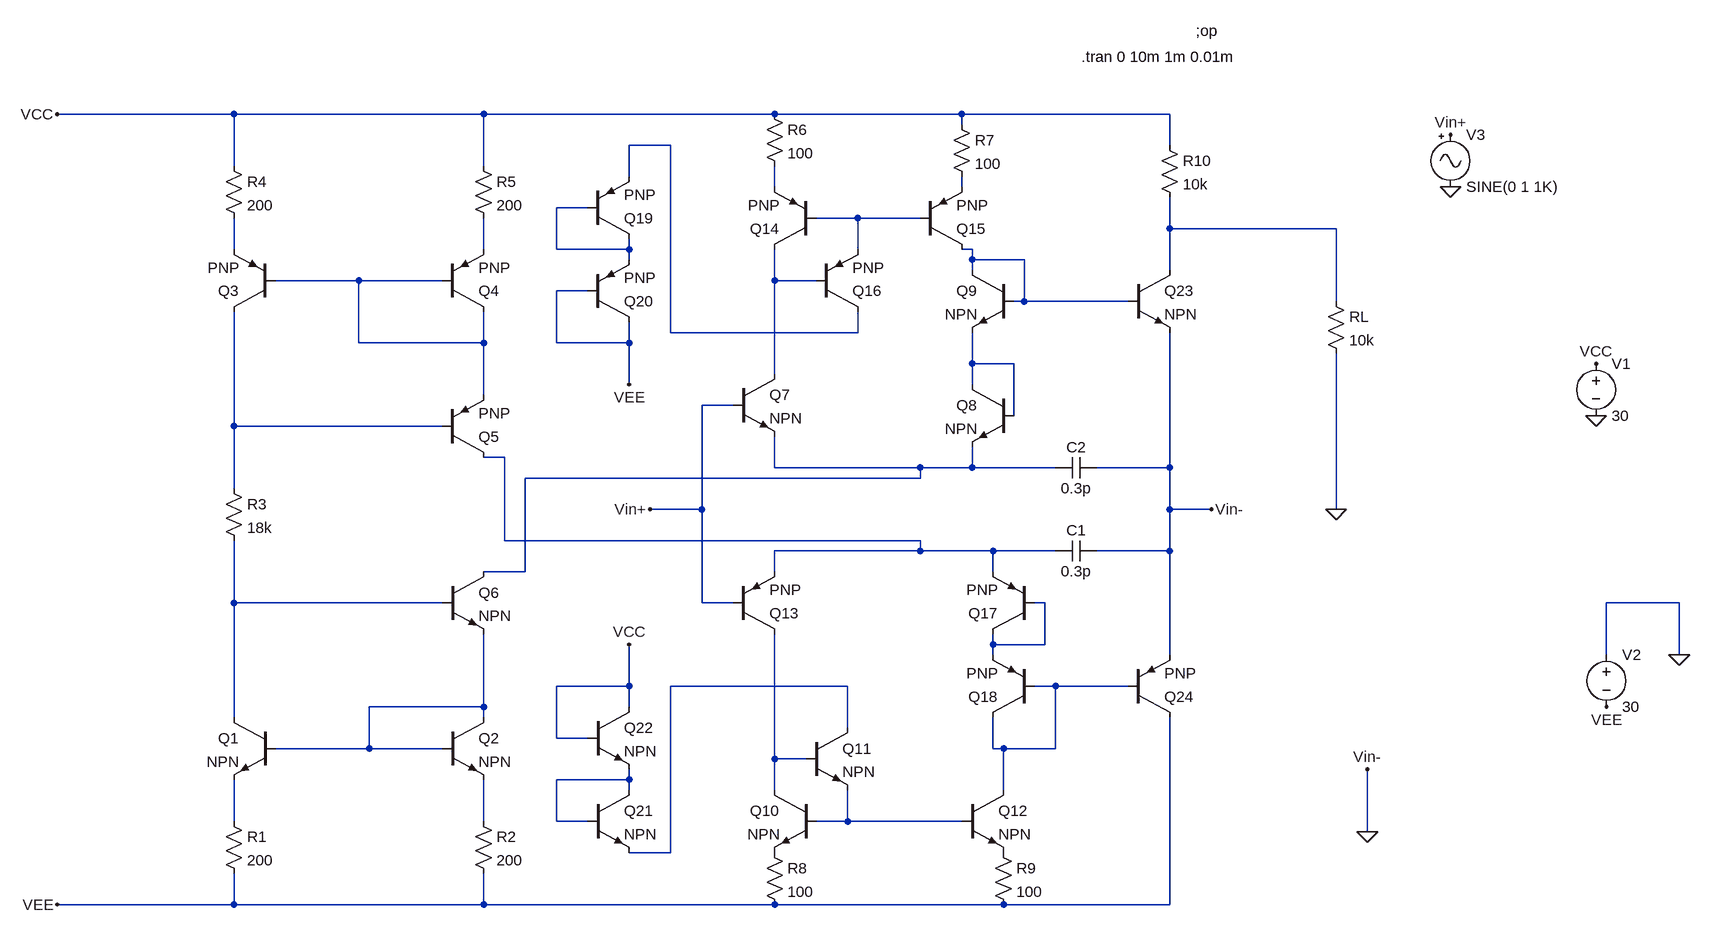
[diagram p0: schematic Draft1.asc]
Draft1.asc, the LTspice schematic file:
Version 4
SHEET 1 1828 1100
WIRE -416 -176 -688 -176
WIRE -32 -176 -416 -176
WIRE 416 -176 -32 -176
WIRE 704 -176 416 -176
WIRE 1024 -176 704 -176
WIRE 704 -160 704 -176
WIRE 256 -128 192 -128
WIRE 1024 -128 1024 -176
WIRE -416 -96 -416 -176
WIRE -32 -96 -32 -176
WIRE 192 -80 192 -128
WIRE 416 -64 416 -96
WIRE 704 -64 704 -80
WIRE 128 -32 80 -32
WIRE 544 -16 480 -16
WIRE 640 -16 544 -16
WIRE 1024 0 1024 -48
WIRE 1280 0 1024 0
WIRE -416 32 -416 -16
WIRE -32 32 -32 -16
WIRE 80 32 80 -32
WIRE 192 32 192 16
WIRE 192 32 80 32
WIRE 544 32 544 -16
WIRE 720 32 704 32
WIRE 192 48 192 32
WIRE 720 48 720 32
WIRE 800 48 720 48
WIRE 720 64 720 48
WIRE 1024 64 1024 0
WIRE -224 80 -352 80
WIRE -96 80 -224 80
WIRE 416 80 416 32
WIRE 480 80 416 80
WIRE 128 96 80 96
WIRE 800 112 800 48
WIRE 800 112 784 112
WIRE 960 112 800 112
WIRE 1280 112 1280 0
WIRE 256 160 256 -128
WIRE 544 160 544 128
WIRE 544 160 256 160
WIRE -224 176 -224 80
WIRE -32 176 -32 128
WIRE -32 176 -224 176
WIRE 80 176 80 96
WIRE 192 176 192 144
WIRE 192 176 80 176
WIRE 720 208 720 160
WIRE 784 208 720 208
WIRE 416 224 416 80
WIRE 192 240 192 176
WIRE 720 240 720 208
WIRE -32 256 -32 176
WIRE 352 272 304 272
WIRE 784 288 784 208
WIRE -416 304 -416 128
WIRE -96 304 -416 304
WIRE 0 352 -32 352
WIRE 416 368 416 320
WIRE 640 368 416 368
WIRE 720 368 720 336
WIRE 720 368 640 368
WIRE 848 368 720 368
WIRE 1024 368 1024 160
WIRE 1024 368 912 368
WIRE 640 384 640 368
WIRE 640 384 32 384
WIRE -416 400 -416 304
WIRE 304 432 304 272
WIRE 304 432 224 432
WIRE 1024 432 1024 368
WIRE 1088 432 1024 432
WIRE 1280 432 1280 192
WIRE 0 480 0 352
WIRE 640 480 0 480
WIRE 640 496 640 480
WIRE 640 496 416 496
WIRE 752 496 640 496
WIRE 848 496 752 496
WIRE 1024 496 1024 432
WIRE 1024 496 912 496
WIRE 32 528 32 384
WIRE 32 528 -32 528
WIRE 416 528 416 496
WIRE 752 528 752 496
WIRE -416 576 -416 480
WIRE -96 576 -416 576
WIRE 304 576 304 432
WIRE 352 576 304 576
WIRE 832 576 816 576
WIRE 1808 576 1696 576
WIRE 752 640 752 624
WIRE 832 640 832 576
WIRE 832 640 752 640
WIRE 752 656 752 640
WIRE 1024 656 1024 496
WIRE 1696 656 1696 576
WIRE 1808 656 1808 576
WIRE 192 704 192 640
WIRE 192 704 80 704
WIRE 528 704 256 704
WIRE 848 704 816 704
WIRE 960 704 848 704
WIRE -32 736 -32 624
WIRE -32 736 -208 736
WIRE 192 736 192 704
WIRE -416 752 -416 576
WIRE -32 752 -32 736
WIRE 528 768 528 704
WIRE 80 784 80 704
WIRE 128 784 80 784
WIRE -208 800 -208 736
WIRE -208 800 -352 800
WIRE -96 800 -208 800
WIRE 752 800 752 752
WIRE 768 800 752 800
WIRE 848 800 848 704
WIRE 848 800 768 800
WIRE 416 816 416 624
WIRE 464 816 416 816
WIRE 192 848 192 832
WIRE 192 848 80 848
WIRE 192 864 192 848
WIRE 416 864 416 816
WIRE 768 864 768 800
WIRE -416 912 -416 848
WIRE -32 912 -32 848
WIRE 80 912 80 848
WIRE 128 912 80 912
WIRE 528 912 528 864
WIRE 528 912 480 912
WIRE 704 912 528 912
WIRE 1328 928 1328 832
WIRE 256 960 256 704
WIRE 256 960 192 960
WIRE -416 1040 -416 992
WIRE -416 1040 -688 1040
WIRE -32 1040 -32 992
WIRE -32 1040 -416 1040
WIRE 416 1040 -32 1040
WIRE 768 1040 416 1040
WIRE 1024 1040 1024 752
WIRE 1024 1040 768 1040
FLAG -688 1040 VEE
FLAG -688 -176 VCC
FLAG 224 432 Vin+
FLAG 192 240 VEE
FLAG 192 640 VCC
FLAG 1088 432 Vin-
FLAG 1328 928 0
FLAG 1328 832 Vin-
FLAG 1680 208 VCC
FLAG 1680 288 0
FLAG 1808 656 0
FLAG 1696 736 VEE
FLAG 1456 -64 0
FLAG 1456 -144 Vin+
FLAG 1280 432 0
DATAFLAG 896 112 ""
DATAFLAG 1040 432 ""
DATAFLAG 288 432 ""
DATAFLAG 1280 224 ""
DATAFLAG 1024 368 ""
DATAFLAG 1024 368 ""
DATAFLAG 1024 368 ""
SYMBOL npn -352 752 M0
SYMATTR InstName Q1
SYMBOL npn -96 752 R0
SYMATTR InstName Q2
SYMBOL res -432 896 R0
SYMATTR InstName R1
SYMATTR Value 200
SYMBOL res -48 896 R0
SYMATTR InstName R2
SYMATTR Value 200
SYMBOL res -432 384 R0
SYMATTR InstName R3
SYMATTR Value 18k
SYMBOL res -432 -112 R0
SYMATTR InstName R4
SYMATTR Value 200
SYMBOL res -48 -112 R0
SYMATTR InstName R5
SYMATTR Value 200
SYMBOL pnp -352 128 R180
SYMATTR InstName Q3
SYMBOL pnp -96 128 M180
SYMATTR InstName Q4
SYMBOL pnp -96 352 M180
SYMATTR InstName Q5
SYMBOL npn -96 528 R0
SYMATTR InstName Q6
SYMBOL npn 352 224 R0
SYMATTR InstName Q7
SYMBOL npn 784 240 M0
SYMATTR InstName Q8
SYMBOL npn 784 64 M0
SYMATTR InstName Q9
SYMBOL npn 480 864 M0
SYMATTR InstName Q10
SYMBOL npn 464 768 R0
SYMATTR InstName Q11
SYMBOL npn 704 864 R0
SYMATTR InstName Q12
SYMBOL pnp 480 32 R180
SYMATTR InstName Q14
SYMBOL pnp 640 32 M180
SYMATTR InstName Q15
SYMBOL pnp 480 128 M180
SYMATTR InstName Q16
SYMBOL pnp 352 624 M180
SYMATTR InstName Q13
SYMBOL pnp 816 624 R180
SYMATTR InstName Q17
SYMBOL pnp 816 752 R180
SYMATTR InstName Q18
SYMBOL res 400 -192 R0
SYMATTR InstName R6
SYMATTR Value 100
SYMBOL res 688 -176 R0
SYMATTR InstName R7
SYMATTR Value 100
SYMBOL res 400 944 R0
SYMATTR InstName R8
SYMATTR Value 100
SYMBOL res 752 944 R0
SYMATTR InstName R9
SYMATTR Value 100
SYMBOL pnp 128 16 M180
SYMATTR InstName Q19
SYMBOL pnp 128 144 M180
SYMATTR InstName Q20
SYMBOL npn 128 864 R0
SYMATTR InstName Q21
SYMBOL npn 128 736 R0
SYMATTR InstName Q22
SYMBOL cap 912 480 R90
WINDOW 0 0 32 VBottom 2
WINDOW 3 32 32 VTop 2
SYMATTR InstName C1
SYMATTR Value 0.3p
SYMBOL cap 912 352 R90
WINDOW 0 0 32 VBottom 2
WINDOW 3 32 32 VTop 2
SYMATTR InstName C2
SYMATTR Value 0.3p
SYMBOL npn 960 64 R0
SYMATTR InstName Q23
SYMBOL pnp 960 752 M180
SYMATTR InstName Q24
SYMBOL voltage 1680 192 R0
WINDOW 123 0 0 Left 2
WINDOW 39 0 0 Left 2
SYMATTR InstName V1
SYMATTR Value 30
SYMBOL voltage 1696 640 R0
SYMATTR InstName V2
SYMATTR Value 30
SYMBOL Misc\\signal 1456 -160 R0
SYMATTR InstName V3
SYMBOL res 1264 96 R0
SYMATTR InstName RL
SYMATTR Value 10k
SYMBOL res 1008 -144 R0
SYMATTR InstName R10
SYMATTR Value 10k
TEXT 1064 -304 Left 2 !;op
TEXT 888 -264 Left 2 !.tran 0 10m 1m 0.01m

The netlist it stands for:
* Draft1.asc
Q1 N016 N020 N023 0 NPN
Q2 N020 N020 N024 0 NPN
R1 N023 VEE 200
R2 N024 VEE 200
R3 N013 N016 18k
R4 VCC N007 200
R5 VCC N008 200
Q3 N013 N010 N007 0 PNP
Q4 N010 N010 N008 0 PNP
Q5 N014 N013 N010 0 PNP
Q6 N015 N016 N020 0 NPN
Q7 N011 Vin+ N015 0 NPN
Q8 N012 N012 N015 0 NPN
Q9 N009 N009 N012 0 NPN
Q10 N021 N025 P001 0 NPN
Q11 N018 N021 N025 0 NPN
Q12 N019 N025 P002 0 NPN
Q14 N011 N005 N002 0 PNP
Q15 N009 N005 N003 0 PNP
Q16 N001 N011 N005 0 PNP
Q13 N021 Vin+ N014 0 PNP
Q17 N017 N017 N014 0 PNP
Q18 N019 N019 N017 0 PNP
R6 VCC N002 100
R7 VCC N003 100
R8 P001 VEE 100
R9 P002 VEE 100
Q19 N004 N004 N001 0 PNP
Q20 VEE VEE N004 0 PNP
Q21 N022 N022 N018 0 NPN
Q22 VCC VCC N022 0 NPN
C1 0 N014 0.3p
C2 0 N015 0.3p
Q23 N006 N009 0 0 NPN
Q24 VEE N019 0 0 PNP
V1 VCC 0 30
V2 0 VEE 30
V3 Vin+ 0 SINE(0 1 1K)
RL N006 0 10k
R10 VCC N006 10k
.model NPN NPN
.model PNP PNP
.lib standard.bjt
;op
.tran 0 10m 1m 0.01m
.backanno
.end